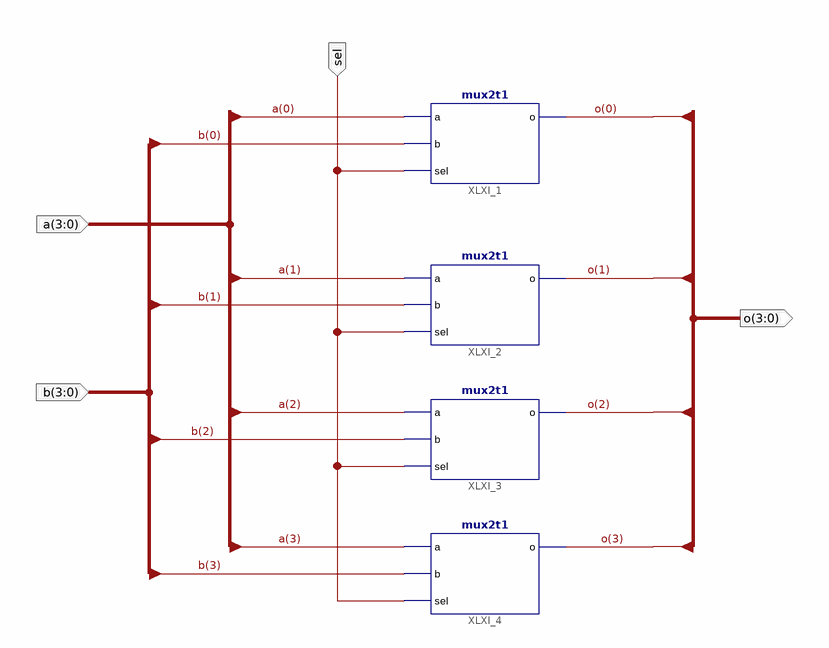
[diagram p0: schematic sheet 1]
// Xilinx ISE schematic mux2t1_4.sch (kintex7) as structural Verilog: 4 symbols, 4 ports
module mux2t1_4 (
  input  sel,
  input  [3:0] a,
  input  [3:0] b,
  output [3:0] o
);

  mux2t1 XLXI_1 (.a(a[0]), .b(b[0]), .sel(sel), .o(o[0]));
  mux2t1 XLXI_2 (.a(a[1]), .b(b[1]), .sel(sel), .o(o[1]));
  mux2t1 XLXI_3 (.a(a[2]), .b(b[2]), .sel(sel), .o(o[2]));
  mux2t1 XLXI_4 (.a(a[3]), .b(b[3]), .sel(sel), .o(o[3]));
endmodule
